# Altium schematic sheet power_input.SchDoc
size A4; SheetNumber: 3; SheetTotal: 11
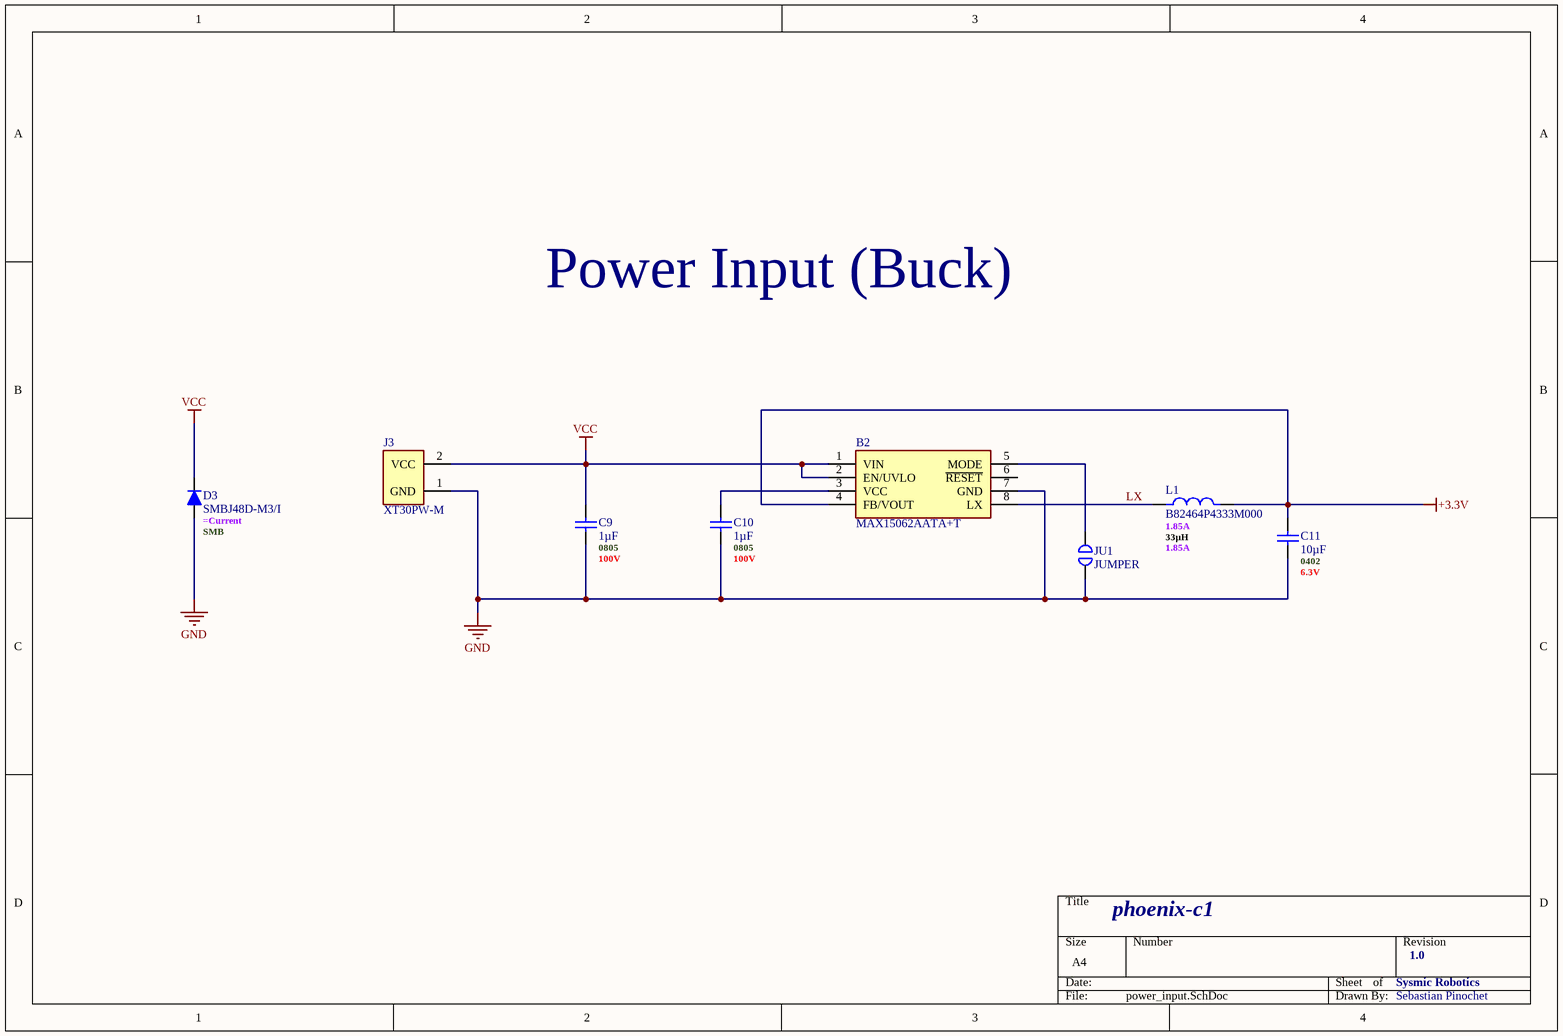
[diagram p0: power_input.SchDoc]

## Parts
B2  MAX15062AATA+T  [8-TDFN - ANALOG]
C9  1µF  .Case/Package: 0805  .Voltage Rating (DC): 100V  [C0805 - MURATA]
C10  1µF  .Case/Package: 0805  .Voltage Rating (DC): 100V  [C0805 - MURATA]
C11  10µF  .Case/Package: 0402  .Voltage Rating (DC): 6.3V  [C0402 - MURATA]
D3  SMBJ48D-M3/I  .Case/Package: SMB  [DDO-214AA (SMBJ) - VISHAY]
J3  XT30PW-M  [CONN - XT30PW-M]
JU1  JUMPER  [JUMPER]
L1  B82464P4333M000  .RMS Current (Irms): 1.85A  .Value: 33µH  [SRN4018-330M]

## Nets
+3.3V: B2.4(FB/VOUT) C11.2 L1.2
GND: B2.7(GND) C9.1 C10.1 C11.1 D3.2 J3.1(GND) JU1.1
VCC: B2.1(VIN) B2.2(EN/UVLO) C9.2 D3.1 J3.2(VCC)
LX: B2.8(LX) L1.1
NetB2_3: B2.3(VCC) C10.2
NetB2_5: B2.5(MODE) JU1.2

Not connected (* = marked no-connect by the designer): B2 6(~{RESET})

## Notes on the sheet
- Power Input (Buck)
- phoenix-c1
- Sysmic Robotics
- 1.0
- Sebastian Pinochet

## Library data of the parts
B2 = MAX15062AATA+T: Step-Down 60V, 300mA, Ultra-Small, High-Efficiency, Synchronous  DC-DC Converters; Manufacturer_Name: Analog Devices; Geometry.Height: 0.8mm; Mouser Part Number: 700-MAX15062AATA+T; Mouser Price/Stock: https://www.mouser.co.uk/ProductDetail/Analog-Devices-Maxim-Integrated/MAX15062AATA%2bT?qs=ffX8NcjNb2RbIuhbYBH8PA%3D%3D; Manufacturer_Part_Number: MAX15062AATA+T; Datasheet Link: https://www.analog.com/MAX15062/datasheet; Supplier 1: Mouser; Supplier Part Number 1: 700-MAX15062AATA+T
C9 C10 = GCM21BC72A105KE36L: Ceramic Capacitor, Ceramic, 100V, 10% +Tol, 10% -Tol, X7S, 22% TC, 1uF, Surface Mount, 0805; Manufacturer: Murata; Manufacturer Lifecycle Status: IN PRODUCTION; Supplier: Mouser; Supplier Part Number: 81-GCM21BC72A105KE6L; Manufacturer Part Number: GCM21BC72A105KE36L; RoHS: Compliant; Category: Ceramic Capacitors; Stock: 5295; Pricing: 1=0,42, 10=0,188, 50=0,188, 100=0,164, 1000=0,123, 10000=0,085 (USD); Value: 1µF; Case/Package: 0805; Dielectric Material: Ceramic; Height: 1.25mm; Length: 2mm; Lifecycle Status: Production; Material: Ceramic; Max Operating Temperature: 125°C; Min Operating Temperature: -55°C; Mounting Technology: Surface Mount; Number of Terminals: 2; REACH SVHC: Yes; Schedule B: 8532240020, 8532240020|8532240020, 8532240020|8532240020|8532240020, 8532240020|8532240020|8532240020|8532240020; Thickness: 1.25mm; Voltage Rating: 100V; Voltage Rating (DC): 100V; Width: 1.25mm; ComponentLink1URL: https://datasheet.octopart.com:443/GCM21BC72A105KE36L-Murata-datasheet-141268580.pdf?src-supplier=Ciiva; ComponentLink1Description: https://datasheet.octopart.com:443/GCM21BC72A105KE36L-Murata-datasheet-141268580.pdf?src-supplier=Ciiva; ComponentLink2URL: https://datasheet.octopart.com:443/GCM21BC72A105KE36L-Murata-datasheet-140660122.pdf?src-supplier=Ciiva; ComponentLink2Description: https://datasheet.octopart.com:443/GCM21BC72A105KE36L-Murata-datasheet-140660122.pdf?src-supplier=Ciiva; ComponentLink3URL: https://datasheet.octopart.com:443/GCM21BC72A105KE36L-Murata-datasheet-138719526.pdf?src-supplier=Ciiva; ComponentLink3Description: https://datasheet.octopart.com:443/GCM21BC72A105KE36L-Murata-datasheet-138719526.pdf?src-supplier=Ciiva; ComponentLink4URL: https://datasheet.octopart.com:443/GCM21BC72A105KE36L-Murata-datasheet-12511495.pdf?src-supplier=TME; ComponentLink4Description: https://datasheet.octopart.com:443/GCM21BC72A105KE36L-Murata-datasheet-12511495.pdf?src-supplier=TME; ComponentLink5URL: http://sigma.octopart.com:80/reach_statement/Murata-company-16.pdf?src-supplier=Compliance+Statements; ComponentLink5Description: http://sigma.octopart.com:80/reach_statement/Murata-company-16.pdf?src-supplier=Compliance+Statements; Supplier 1: Mouser; Supplier Part Number 1: 81-GCM21BC72A105KE6L
C11 = GRM155R60J106ME05D: Ceramic Capacitor, Ceramic, 6.3V, 20% +Tol, 20% -Tol, X5R, 15% TC, 10uF, Surface Mount, 0402; Manufacturer: Murata; Manufacturer Lifecycle Status: IN PRODUCTION; Supplier: Mouser; Supplier Part Number: 81-GRM155R60J106M05D; Manufacturer Part Number: GRM155R60J106ME05D; RoHS: Compliant; Category: Ceramic Capacitors; Stock: 374888; Pricing: 1=0,1, 10=0,021, 50=0,021, 100=0,019, 1000=0,018, 10000=0,014 (USD); Value: 10µF; Case/Package: 0402; Dielectric: X5R; Dielectric Material: Ceramic; Height: 500µm; Length: 1mm; Lifecycle Status: Production; Material: Ceramic; Max Operating Temperature: 85°C; Min Operating Temperature: -55°C; Mounting Technology: Surface Mount; Number of Terminals: 2; REACH SVHC: Yes; Schedule B: 8532240020|8532240020|8532240020|8532240020|8532240020|8532240020|8532240020|8532240020|8532240020|8532240020|8532240020|8532240020|8532240020|8532240020|8532240020|8532240020|8532240020|8532240020|8532240020|8532240020|8532240020|8532240020|8532240020|85; Thickness: 500µm; Tolerance: 20%; Voltage Rating: 6.3V; Voltage Rating (DC): 6.3V; Width: 500µm; ComponentLink1URL: https://datasheet.octopart.com:443/GRM155R60J106ME05D-Murata-datasheet-155239051.pdf?src-supplier=Newark; ComponentLink1Description: https://datasheet.octopart.com:443/GRM155R60J106ME05D-Murata-datasheet-155239051.pdf?src-supplier=Newark; ComponentLink2URL: https://datasheet.octopart.com:443/GRM155R60J106ME05D-Murata-datasheet-165579666.pdf?src-supplier=TME; ComponentLink2Description: https://datasheet.octopart.com:443/GRM155R60J106ME05D-Murata-datasheet-165579666.pdf?src-supplier=TME; ComponentLink3URL: https://datasheet.octopart.com:443/GRM155R60J106ME05D-Murata-datasheet-141266224.pdf?src-supplier=Ciiva; ComponentLink3Description: https://datasheet.octopart.com:443/GRM155R60J106ME05D-Murata-datasheet-141266224.pdf?src-supplier=Ciiva; ComponentLink4URL: https://datasheet.octopart.com:443/GRM155R60J106ME05D-Murata-datasheet-140689296.pdf?src-supplier=Ciiva; ComponentLink4Description: https://datasheet.octopart.com:443/GRM155R60J106ME05D-Murata-datasheet-140689296.pdf?src-supplier=Ciiva; ComponentLink5URL: https://datasheet.octopart.com:443/GRM155R60J106ME05D-Murata-datasheet-138740637.pdf?src-supplier=Ciiva; ComponentLink5Description: https://datasheet.octopart.com:443/GRM155R60J106ME05D-Murata-datasheet-138740637.pdf?src-supplier=Ciiva; ComponentLink6URL: https://datasheet.octopart.com/GRM155R60J106ME05D-Murata-datasheet-12515295.pdf; ComponentLink6Description: https://datasheet.octopart.com/GRM155R60J106ME05D-Murata-datasheet-12515295.pdf; ComponentLink7URL: https://datasheet.octopart.com/GRM155R60J106ME05D-Murata-datasheet-12510076.pdf; ComponentLink7Description: https://datasheet.octopart.com/GRM155R60J106ME05D-Murata-datasheet-12510076.pdf; ComponentLink8URL: https://datasheet.octopart.com/GRM155R60J106ME05D-Murata-datasheet-11978611.pdf; ComponentLink8Description: https://datasheet.octopart.com/GRM155R60J106ME05D-Murata-datasheet-11978611.pdf; ComponentLink9URL: https://datasheet.octopart.com/GRM155R60J106ME05D-Murata-datasheet-10025737.pdf; ComponentLink9Description: https://datasheet.octopart.com/GRM155R60J106ME05D-Murata-datasheet-10025737.pdf; ComponentLink10URL: https://datasheet.octopart.com/GRM155R60J106ME05D-Murata-datasheet-8819587.pdf; ComponentLink10Description: https://datasheet.octopart.com/GRM155R60J106ME05D-Murata-datasheet-8819587.pdf; ComponentLink11URL: http://sigma.octopart.com:80/reach_statement/Murata-company-16.pdf?src-supplier=Compliance+Statements; ComponentLink11Description: http://sigma.octopart.com:80/reach_statement/Murata-company-16.pdf?src-supplier=Compliance+Statements; Supplier 1: Mouser; Supplier Part Number 1: 81-GRM155R60J106M05D
D3 = SMBJ48D-M3/I: Trans Voltage Suppressor Diode, 600W, 48V V(RWM), Unidirectional, 1 Element, Silicon, DO-214AA; Manufacturer: Vishay; Breakdown Voltage: 56.1V; Clamping Voltage: 76.3V; Max Breakdown Voltage: 58.1V; Max Power Dissipation: 1W; Min Breakdown Voltage: 54.1V; Number of Elements: 1; Peak Pulse Current: 7.9A; Power Line Protection: No; Supplier: Mouser; Supplier Part Number: 78-SMBJ48D-M3I; Manufacturer Part Number: SMBJ48D-M3/I; RoHS: Compliant; Category: TVS Diodes; Stock: 7114; Pricing: 1=0,34, 10=0,24, 50=0,24, 100=0,091, 1000=0,091, 10000=0,073 (USD); Case/Package: SMB; China RoHS: Non-Compliant; Composition: Zener; Lifecycle Status: Production; Max Operating Temperature: 150°C; Min Operating Temperature: -55°C; Mounting Technology: Surface Mount; Number of Terminals: 2; Number of Unidirectional Channels: 1; Packaging: Tape & Reel (TR); Peak Pulse Power: 600W; Polarity: Unidirectional; REACH SVHC: No; Reverse Standoff Voltage: 48V; ComponentLink1URL: https://datasheet.octopart.com:443/SMBJ48D-M3-I-Vishay-datasheet-168801400.pdf?src-supplier=IHS; ComponentLink1Description: https://datasheet.octopart.com:443/SMBJ48D-M3-I-Vishay-datasheet-168801400.pdf?src-supplier=IHS; ComponentLink2URL: https://datasheet.octopart.com:443/SMBJ48D-M3-I-Vishay-datasheet-141892618.pdf?src-supplier=Future+Electronics; ComponentLink2Description: https://datasheet.octopart.com:443/SMBJ48D-M3-I-Vishay-datasheet-141892618.pdf?src-supplier=Future+Electronics; ComponentLink3URL: http://sigma.octopart.com:80/rohs_statement/Vishay-company-15.pdf?src-supplier=Compliance+Statements; ComponentLink3Description: http://sigma.octopart.com:80/rohs_statement/Vishay-company-15.pdf?src-supplier=Compliance+Statements; Supplier 1: Mouser; Supplier Part Number 1: 78-SMBJ48D-M3I; .Current: =Current
J3 = XT30PW-M: 30A Low Temperature Rise Fire Retardant Plug; Manufacturer_Name: Amass; Geometry.Height: 5mm; Mouser Part Number: *; Mouser Price/Stock: *; Arrow Part Number: *; Arrow Price/Stock: *; Datasheet Link: https://www.tme.eu/sl/Document/ce4077e36b79046da520ca73227e15de/XT30PW%20SPEC.pdf; Manufacturer_Part_Number: XT30PW-M
L1 = LPS4018-333MRC: General Purpose Inductor, 33uH, 20%, 1 Element, Ferrite-Core, SMD, 1515; Manufacturer: EPCOS; Manufacturer Lifecycle Status: PRODUCTION; DC Resistance (DCR): 75mΩ; Value: 33µH; Number of Circuits: 1; Saturation Current: 2.1A; Shielding: Yes; Test Frequency: 100kHz; Current Rating: 260mA; Q Factor: 30; Self Resonant Frequency: 60MHz; Max Saturation Current: 450mA; Max Temperature Rise Current: 600mA; Temperature Rise Current: 650mA; Supplier: Mouser; Supplier Part Number: 871-B82464P4333M; Manufacturer Part Number: B82464P4333M000; RoHS: Compliant; Category: Fixed Inductors; Stock: 942; Pricing: 1=1,59, 10=1,31, 50=1,14, 100=1,08, 1000=0,885, 10000=0,775 (USD); Case/Package: SMD/SMT; Contact Plating: Tin; Core Material: Ferrite; DC Current: 1.85A; Depth: 10.4mm; Height: 4.8mm; Inductance Tolerance: 20%; Length: 10.4mm; Lifecycle Status: Production; Max Current Rating: 1.85A; Max DC Current: 1.85A; Max Length: 10.4mm; Max Operating Temperature: 150°C; Max Width: 10.4mm; Military Standard: Not; Min Operating Temperature: -55°C; Mounting Technology: Surface Mount; Number of Terminals: 2; REACH SVHC: Yes; RMS Current (Irms): 1.85A; Tolerance: 20%; Width: 10.4mm; ComponentLink1URL: https://datasheet.octopart.com:443/B82464P4333M000-EPCOS-datasheet-155394167.pdf?src-supplier=IHS; ComponentLink1Description: https://datasheet.octopart.com:443/B82464P4333M000-EPCOS-datasheet-155394167.pdf?src-supplier=IHS; ComponentLink2URL: https://datasheet.octopart.com:443/B82464P4333M000-EPCOS-datasheet-13705212.pdf?src-supplier=EPCOS; ComponentLink2Description: https://datasheet.octopart.com:443/B82464P4333M000-EPCOS-datasheet-13705212.pdf?src-supplier=EPCOS; ComponentLink3URL: https://datasheet.octopart.com:443/B82464P4333M000-EPCOS-datasheet-66576979.pdf?src-supplier=Newark; ComponentLink3Description: https://datasheet.octopart.com:443/B82464P4333M000-EPCOS-datasheet-66576979.pdf?src-supplier=Newark; ComponentLink4URL: https://datasheet.octopart.com:443/B82464P4333M000-EPCOS-datasheet-34142370.pdf?src-supplier=Newark; ComponentLink4Description: https://datasheet.octopart.com:443/B82464P4333M000-EPCOS-datasheet-34142370.pdf?src-supplier=Newark; ComponentLink5URL: https://datasheet.octopart.com:443/B82464P4333M000-EPCOS-datasheet-11522271.pdf?src-supplier=element14+APAC; ComponentLink5Description: https://datasheet.octopart.com:443/B82464P4333M000-EPCOS-datasheet-11522271.pdf?src-supplier=element14+APAC; Case Code (Imperial): 1210; Case Code (Metric): 3225; Composition: Wirewound; Height - Seated (Max): 2.3876mm; Lead Free: Lead Free; Min Length: 3mm; Min Width: 2.3mm; Schedule B: 8504500000, 8504500000|8504500000|8504500000|8504500000|8504500000; Termination: SMD/SMT; Weight: 50.008559mg; ComponentLink6URL: https://datasheet.octopart.com:443/NLV32T-3R3J-EF-TDK-datasheet-181268619.pdf?src-supplier=IHS; ComponentLink6Description: https://datasheet.octopart.com:443/NLV32T-3R3J-EF-TDK-datasheet-181268619.pdf?src-supplier=IHS; ComponentLink7URL: https://datasheet.octopart.com:443/NLV32T-3R3J-EF-TDK-datasheet-155380433.pdf?src-supplier=TDK; ComponentLink7Description: https://datasheet.octopart.com:443/NLV32T-3R3J-EF-TDK-datasheet-155380433.pdf?src-supplier=TDK; ComponentLink8URL: https://datasheet.octopart.com:443/NLV32T-3R3J-EF-TDK-datasheet-97126320.pdf?src-supplier=Newark; ComponentLink8Description: https://datasheet.octopart.com:443/NLV32T-3R3J-EF-TDK-datasheet-97126320.pdf?src-supplier=Newark; ComponentLink9URL: https://datasheet.octopart.com:443/NLV32T-3R3J-EF-TDK-datasheet-81471259.pdf?src-supplier=Newark; ComponentLink9Description: https://datasheet.octopart.com:443/NLV32T-3R3J-EF-TDK-datasheet-81471259.pdf?src-supplier=Newark; ComponentLink10URL: https://datasheet.octopart.com:443/NLV32T-3R3J-EF-TDK-datasheet-136874827.pdf?src-supplier=TME; ComponentLink10Description: https://datasheet.octopart.com:443/NLV32T-3R3J-EF-TDK-datasheet-136874827.pdf?src-supplier=TME; ComponentLink11URL: https://datasheet.octopart.com:443/NLV32T-3R3J-EF-TDK-datasheet-61115007.pdf?src-supplier=Future+Electronics; ComponentLink11Description: https://datasheet.octopart.com:443/NLV32T-3R3J-EF-TDK-datasheet-61115007.pdf?src-supplier=Future+Electronics; Packaging: Tape & Reel (TR); ComponentLink12URL: https://datasheet.octopart.com:443/MBKK1608T3R3M-Taiyo-Yuden-datasheet-181265470.pdf?src-supplier=IHS; ComponentLink12Description: https://datasheet.octopart.com:443/MBKK1608T3R3M-Taiyo-Yuden-datasheet-181265470.pdf?src-supplier=IHS; ComponentLink13URL: https://datasheet.octopart.com:443/MBKK1608T3R3M-Taiyo-Yuden-datasheet-154809596.pdf?src-supplier=Master+Electronics; ComponentLink13Description: https://datasheet.octopart.com:443/MBKK1608T3R3M-Taiyo-Yuden-datasheet-154809596.pdf?src-supplier=Master+Electronics; ComponentLink14URL: https://datasheet.octopart.com:443/MBKK1608T3R3M-Taiyo-Yuden-datasheet-168245478.pdf?src-supplier=Future+Electronics; ComponentLink14Description: https://datasheet.octopart.com:443/MBKK1608T3R3M-Taiyo-Yuden-datasheet-168245478.pdf?src-supplier=Future+Electronics; ComponentLink15URL: https://datasheet.octopart.com:443/MBKK1608T3R3M-Taiyo-Yuden-datasheet-140707427.pdf?src-supplier=Taiyo+Yuden+SCT; ComponentLink15Description: https://datasheet.octopart.com:443/MBKK1608T3R3M-Taiyo-Yuden-datasheet-140707427.pdf?src-supplier=Taiyo+Yuden+SCT; ComponentLink16URL: https://datasheet.octopart.com:443/LPS4018-333MRC-Coilcraft-datasheet-178522552.pdf?src-supplier=IHS; ComponentLink16Description: https://datasheet.octopart.com:443/LPS4018-333MRC-Coilcraft-datasheet-178522552.pdf?src-supplier=IHS; ComponentLink17URL: https://datasheet.octopart.com:443/LPS4018-333MRC-Coilcraft-datasheet-10791166.pdf?src-supplier=Coilcraft+Direct; ComponentLink17Description: https://datasheet.octopart.com:443/LPS4018-333MRC-Coilcraft-datasheet-10791166.pdf?src-supplier=Coilcraft+Direct; Supplier 1: Mouser; Supplier Part Number 1: 994-LPS4018-333MRC; .Max DC Current: 1.85A